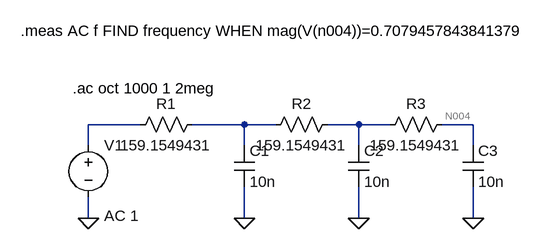
[diagram p0: schematic lpf_3rd_ord.asc]
lpf_3rd_ord.asc, the LTspice schematic file:
Version 4.1
SHEET 1 880 680
WIRE 48 112 -32 112
WIRE 208 112 128 112
WIRE 256 112 208 112
WIRE 384 112 336 112
WIRE 432 112 384 112
WIRE 560 112 512 112
WIRE -32 144 -32 112
WIRE 208 144 208 112
WIRE 384 144 384 112
WIRE 560 144 560 112
WIRE -32 256 -32 224
WIRE 208 256 208 208
WIRE 384 256 384 208
WIRE 560 256 560 208
FLAG 208 256 0
FLAG -32 256 0
FLAG 384 256 0
FLAG 560 256 0
SYMBOL voltage -32 128 R0
WINDOW 3 24 152 Left 2
WINDOW 123 24 124 Left 2
WINDOW 39 0 0 Left 0
SYMATTR Value ""
SYMATTR Value2 AC 1
SYMATTR InstName V1
SYMBOL res 144 96 R90
WINDOW 0 0 56 VBottom 2
WINDOW 3 32 56 VTop 2
SYMATTR InstName R1
SYMATTR Value 159.1549431
SYMBOL cap 192 144 R0
SYMATTR InstName C1
SYMATTR Value 10n
SYMBOL res 352 96 R90
WINDOW 0 0 56 VBottom 2
WINDOW 3 32 56 VTop 2
SYMATTR InstName R2
SYMATTR Value 159.1549431
SYMBOL cap 368 144 R0
SYMATTR InstName C2
SYMATTR Value 10n
SYMBOL res 528 96 R90
WINDOW 0 0 56 VBottom 2
WINDOW 3 32 56 VTop 2
SYMATTR InstName R3
SYMATTR Value 159.1549431
SYMBOL cap 544 144 R0
SYMATTR InstName C3
SYMATTR Value 10n
TEXT -56 56 Left 2 !.ac oct 1000 1 2meg
TEXT -136 -32 Left 2 !.meas AC f FIND frequency WHEN mag(V(n004))=0.7079457843841379

The netlist it stands for:
* lpf_3rd_ord.asc
V1 N001 0 AC 1
R1 N002 N001 159.1549431
C1 N002 0 10n
R2 N003 N002 159.1549431
C2 N003 0 10n
R3 N004 N003 159.1549431
C3 N004 0 10n
.ac oct 1000 1 2meg
.meas AC f FIND frequency WHEN mag(V(n004))=0.7079457843841379
.backanno
.end